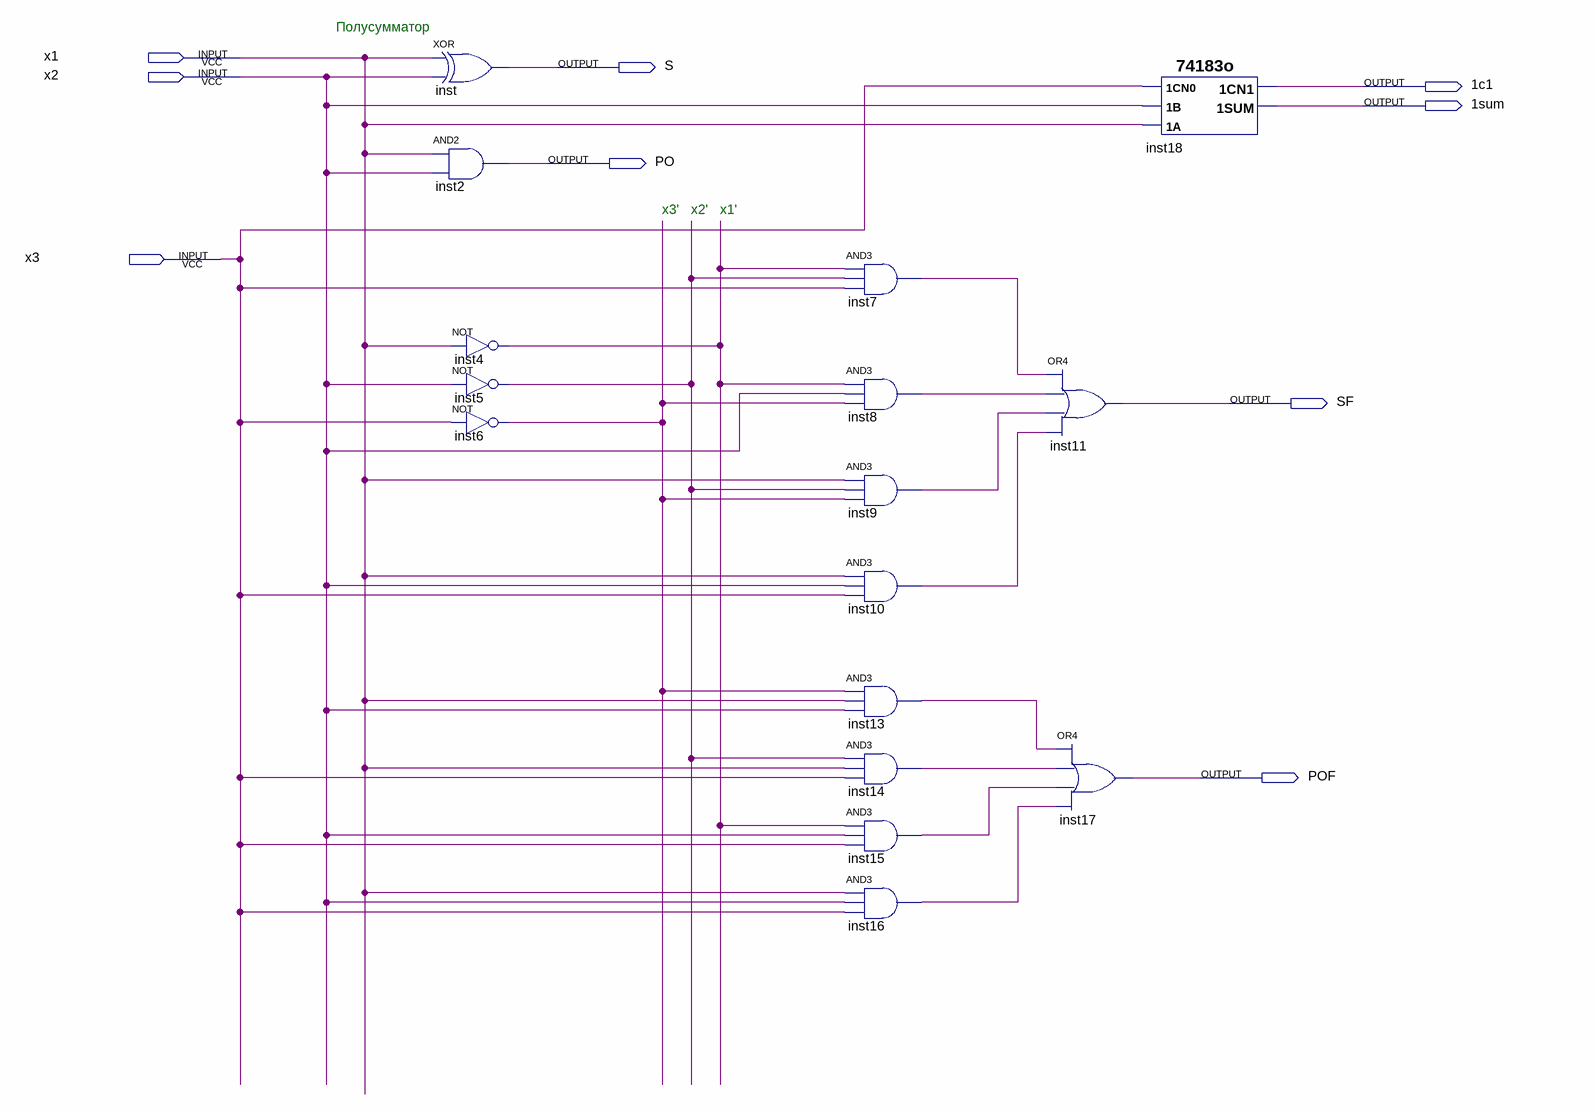
[diagram p0: schematic sheet]
// Quartus schematic cmd4.bdf as structural Verilog: 16 symbols, 9 pins
module cmd4 (
  input  x1,
  input  x2,
  input  x3,
  output S,
  output \1с1 ,
  output \1sum ,
  output PO,
  output SF,
  output POF
);

  wire inst4_out, inst5_out, inst6_out, inst7_out, inst8_out, inst9_out, inst10_out, inst13_out, inst14_out,
       inst15_out, inst16_out;

  xor inst (S, x1, x2);
  and inst2 (PO, x1, x2);
  not inst4 (inst4_out, x1);
  not inst5 (inst5_out, x2);
  not inst6 (inst6_out, x3);
  and inst7 (inst7_out, inst4_out, inst5_out, x3);
  and inst8 (inst8_out, inst4_out, x2, inst6_out);
  and inst9 (inst9_out, x1, inst5_out, inst6_out);
  and inst10 (inst10_out, x1, x2, x3);
  and inst13 (inst13_out, inst6_out, x1, x2);
  and inst14 (inst14_out, inst5_out, x1, x3);
  and inst15 (inst15_out, inst4_out, x2, x3);
  and inst16 (inst16_out, x1, x2, x3);
  or inst11 (SF, inst7_out, inst8_out, inst9_out, inst10_out);
  or inst17 (POF, inst13_out, inst14_out, inst15_out, inst16_out);
  \74183o  inst18 (.\1CN0 (x3), .\1A (x1), .\1B (x2), .\1CN1 (\1с1 ), .\1SUM (\1sum ));

  // Notes on the sheet:
  //   Полусумматор
  //   x3'
  //   x2'
  //   x1'
endmodule
